# Altium schematic sheet Power.SchDoc: Power
size A4; Engineer: Danel Tiitma; DocumentNumber: 2; Revision: 1; SheetNumber: 2; SheetTotal: 15
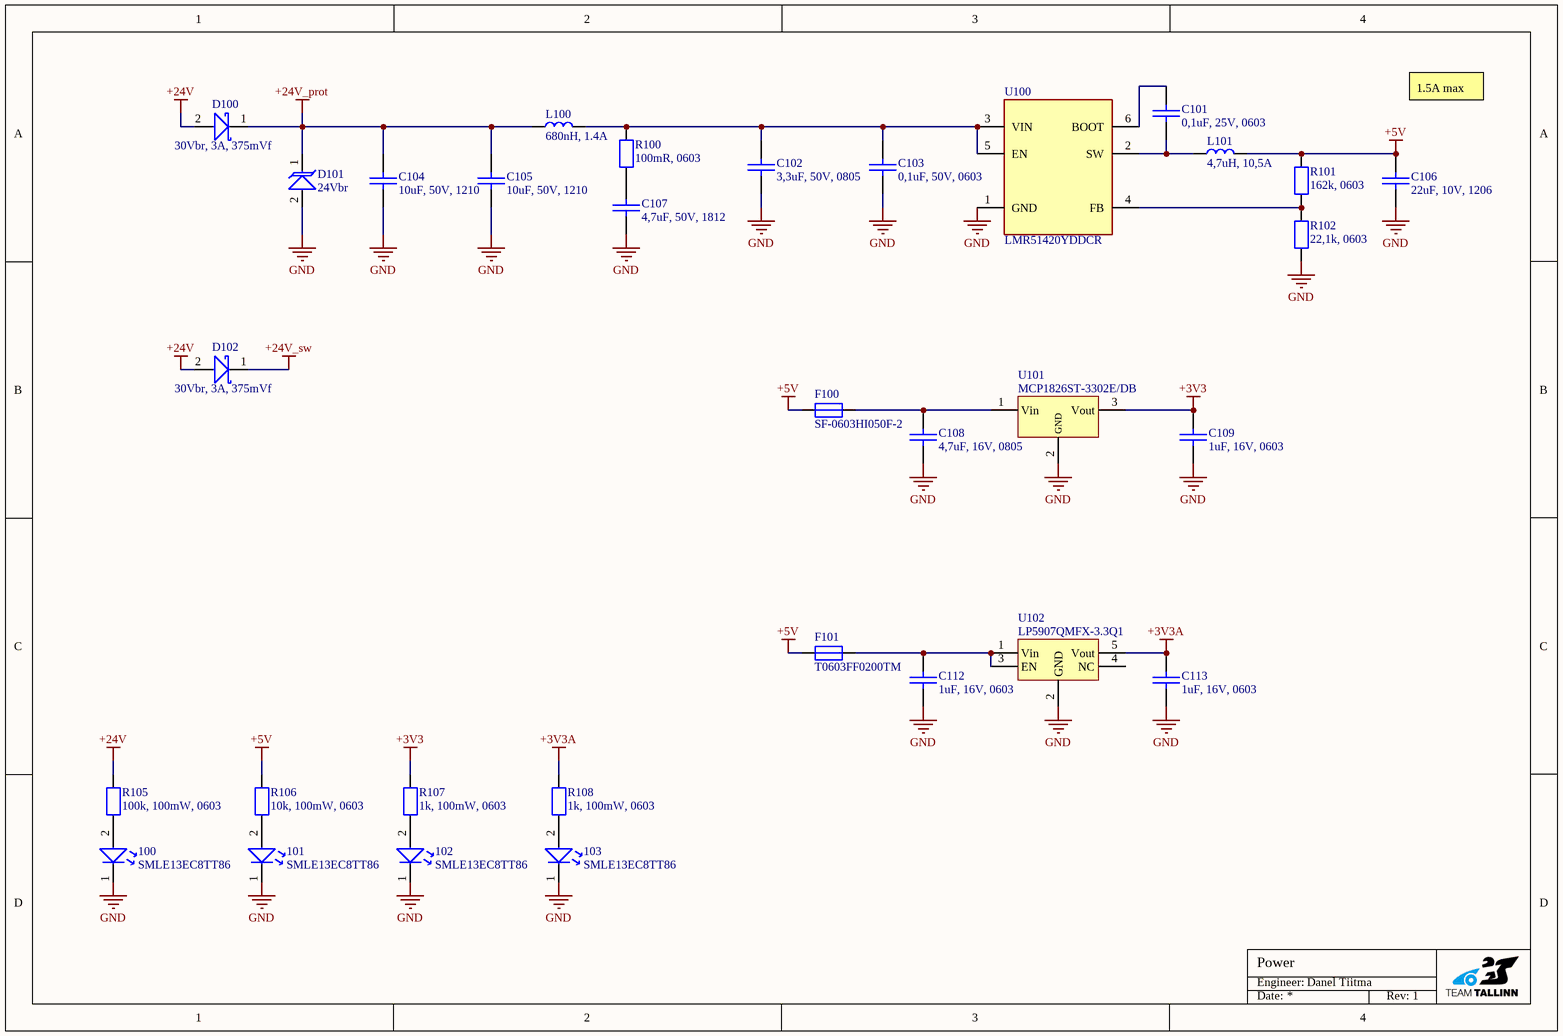
[diagram p0: Power.SchDoc]

## Parts
100  SMLE13EC8TT86  [LED [0603] 1608]
101  SMLE13EC8TT86  [LED [0603] 1608]
102  SMLE13EC8TT86  [LED [0603] 1608]
103  SMLE13EC8TT86  [LED [0603] 1608]
C101  0,1uF, 25V, 0603  [CAP [0603] 1608]
C102  3,3uF, 50V, 0805  [CAP [0805] 2012]
C103  0,1uF, 50V, 0603  [CAP [0603] 1608]
C104  10uF, 50V, 1210  [CAP [1210] 3225]
C105  10uF, 50V, 1210  [CAP [1210] 3225]
C106  22uF, 10V, 1206  [CAP [1206] 3216]
C107  4,7uF, 50V, 1812  [CAP [1812] 4532]
C108  4,7uF, 16V, 0805  [CAP [0805] 2012]
C109  1uF, 16V, 0603  [CAP [0603] 1608]
C112  1uF, 16V, 0603  [CAP [0603] 1608]
C113  1uF, 16V, 0603  [CAP [0603] 1608]
D100  30Vbr, 3A, 375mVf  [SOD-128]
D101  24Vbr  [SOD-123W]
D102  30Vbr, 3A, 375mVf  [SOD-128]
F100  SF-0603HI050F-2  [FUSE [0603] 1608]
F101  T0603FF0200TM  [FUSE [0603] 1608]
L100  680nH, 1.4A  [PFL1609-681MEW-Footprint-1]
L101  4,7uH, 10,5A  [FP-XAL6060-472MEC-MFG]
R100  100mR, 0603  [RES [0603] 1608]
R101  162k, 0603  [RES [0603] 1608]
R102  22,1k, 0603  [RES [0603] 1608]
R105  100k, 100mW, 0603  [RES [0603] 1608]
R106  10k, 100mW, 0603  [RES [0603] 1608]
R107  1k, 100mW, 0603  [RES [0603] 1608]
R108  1k, 100mW, 0603  [RES [0603] 1608]
U100  LMR51420YDDCR  [SOT23-6]
U101  MCP1826ST-3302E/DB  [SOT223]
U102  LP5907QMFX-3.3Q1  [SOT23-5]

## Nets
+3V3: C109.1 R107.2 U101.3(Vout)
+3V3A: C113.1 R108.2 U102.5(Vout)
+5V: C106.2 F100.1 F101.2 L101.2 R101.1 R106.2
+24V: D100.2(A) D102.2(A) R105.2
+24V_prot: C104.1 C105.1 D100.1(K) D101.1(K) L100.1
+24V_sw: D102.1(K)
GND: 100.1 101.1 102.1 103.1 C102.1 C103.1 C104.2 C105.2 C106.1 C107.2 C108.2 C109.2 C112.2 C113.2 D101.2(A) R102.2 U100.1(GND) U101.2(GND) U102.2(GND)
Net100_2: 100.2 R105.1
Net101_2: 101.2 R106.1
Net102_2: 102.2 R107.1
Net103_2: 103.2 R108.1
NetC101_1: C101.1 L101.1 U100.2(SW)
NetC101_2: C101.2 U100.6(BOOT)
NetC102_2: C102.2 C103.2 L100.2 R100.1 U100.3(VIN) U100.5(EN)
NetC107_1: C107.1 R100.2
NetC108_1: C108.1 F100.2 U101.1(Vin)
NetC112_1: C112.1 F101.1 U102.1(Vin) U102.3(EN)
NetR101_2: R101.2 R102.1 U100.4(FB)

Not connected (* = marked no-connect by the designer): U102 4(NC)

## Notes on the sheet
- 1.5A max
- Engineer:
- Date:
- Rev:

## Library data of the parts
100-103 = CMP-004-00006-2: Single Color LED, Green, Colorless Transparent, 1.2mm; Manufacturer Part Number: SMLE13EC8TT86; Supplier Part Number: 755-SMLE13EC8TT86; Supplier: Mouser
C101 C103 C108 C109 C112 C113 = CMP-001-00084-16: Default capacitor part; Supplier Part Number: *; Supplier: *; Manufacturer Part Number: *
C102 = CMP-001-00024-1: Ceramic Capacitor, Multilayer, Ceramic, 50V, 10% +Tol, 10% -Tol, X5R, 15% TC, 3.3uF, Surface Mount, 0805; Manufacturer: TDK; Manufacturer Part Number: C2012X5R1H335K125AB; Supplier Part Number: 810-C2012X5R1H335K; Price: 0,521; Supplier: Mouser
C104 C105 = CMP-001-00022-1: Ceramic Capacitor, Multilayer, Ceramic, 50V, 20% +Tol, 20% -Tol, X7R, 15% TC, 10uF, Surface Mount, 1210; Manufacturer Part Number: C3225X7R1H106M250AC; Manufacturer: TDK; Price: 0,772; Supplier Part Number: 810-C3225X7R1H106MAC; Supplier: Mouser
C106 = CMP-001-00025-1: Ceramic Capacitor, Multilayer, Ceramic, 10V, 10% +Tol, 10% -Tol, X7R, 15% TC, 22uF, Surface Mount, 1206; Manufacturer: Murata; Manufacturer Part Number: GRM31CR71A226KE15L; Supplier Part Number: 81-GRM31CR71A226K15L; Supplier: Mouser
C107 = CMP-001-00023-1: Ceramic Capacitor, Multilayer, Ceramic, 100V, 10% +Tol, 10% -Tol, X7S, 22% TC, 4.7uF, Surface Mount, 1812; Manufacturer Part Number: C4532X7S2A475K230KB; Manufacturer: TDK; Supplier Part Number: 810-C4532X7S2A475KKB; Supplier: Mouser; Price: 1,20
D100 D102 = CMP-004-00015-1: Rectifier Diode, Schottky, 1 Phase, 1 Element, 2A, Silicon; Manufacturer Part Number: PMEG3020EP,115; Supplier Part Number: 771-PMEG3020EP115; Supplier: Mouser
D101 = CMP-004-00014-3: Trans Voltage Suppressor Diode, 400W, 24V V(RWM), Unidirectional, 1 Element, Silicon; Manufacturer Part Number: PTVS24VS1UR,115; Manufacturer: Nexperia; Supplier Part Number: 1829247; Datasheet: https://4donline.ihs.com/images/VipMasterIC/IC/NEXP/NEXP-S-A0003507774/NEXP-S-A0003507774-1.pdf?hkey=6D3A4C79FDBF58556ACFDE234799DDF0; Supplier: Farnell
F100 = CMP-005-00023-1: Electric Fuse, 0.5A, 35VAC, 65VDC, 50A (IR), Surface Mount; Manufacturer: Bourns; Supplier Part Number: 652-SF-0603HI050F-2; Manufacturer Part Number: SF-0603HI050F-2; Supplier: Mouser; Price: 0,605
F101 = CMP-005-00007-2: Fuse, Very Fast Act, 0.2A, 65VDC, 0603 Rohs Compliant: Yes; Supplier Part Number: 3701343; Manufacturer Part Number: T0603FF0200TM; Supplier: Farnell
L100 = CMP-006-00017-1: General Purpose Inductor, 0.68uH, 20%, 1 Element, Composite-Core, SMD, 0603; Manufacturer: Coilcraft; Manufacturer Part Number: PFL1609-681MEW; Datasheet: https://www.mouser.ee/datasheet/2/597/pfl1609-270712.pdf; Supplier: Mouser; Supplier Part Number: 994-PFL1609-681MEW; Price: 0,651
L101 = CMP-006-00022-1: General Purpose Inductor, 4.7uH, 20%, 1 Element, Composite-Core, SMD, 2625; Manufacturer: Coilcraft; Manufacturer Part Number: XAL6060-472MEC; Supplier Part Number: 994-XAL6060-472MEC; Price: 3,06; Supplier: Mouser
R100-R102 R105-R108 = CMP-009-00038-12: Standard resistor part; Supplier Part Number: *; Manufacturer Part Number: *; Supplier: *
U100 = CMP-019-00028-1: SIMPLE SWITCHER® power converter 4.5-V to 36-V, 2-A, synchronous buck with 40-µA IQ 6-SOT-23-THIN -40 to 150; Manufacturer: Texas Instruments; Manufacturer Part Number: LMR51420YDDCR; Supplier: Mouser; Price: 1,07; Datasheet: https://www.ti.com/general/docs/suppproductinfo.tsp?distId=26&gotoUrl=https://www.ti.com/lit/gpn/lmr51420; Supplier Part Number: 595-LMR51420YDDCR
U101 = CMP-019-00036-1: Fixed Positive LDO Regulator, 3.3V, 0.4V Dropout, CMOS, PDSO3; Manufacturer: Microchip; Manufacturer Part Number: 579-MCP1826ST3302EDB; Supplier Part Number: 579-MCP1826ST3302EDB; Supplier: Mouser
U102 = CMP-019-00018-1: Fixed Positive LDO Regulator, 3.3V, 0.25V Dropout, PDSO5; Manufacturer: Texas Instruments; Manufacturer Part Number: LP5907QMFX-3.3Q1; Supplier Part Number: 595-LP5907QMFX-3.3Q1; Supplier: Mouser